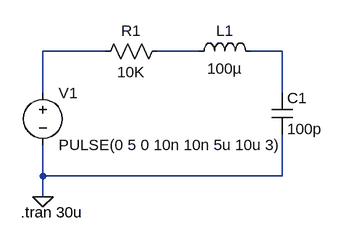
[diagram p0: schematic RLC.asc]
RLC.asc, the LTspice schematic file:
Version 4
SHEET 1 880 680
WIRE 112 48 16 48
WIRE 256 48 192 48
WIRE 384 48 336 48
WIRE 16 112 16 48
WIRE 384 112 384 48
WIRE 16 240 16 192
WIRE 384 240 384 176
WIRE 384 240 16 240
WIRE 16 272 16 240
FLAG 16 272 0
SYMBOL voltage 16 96 R0
WINDOW 123 0 0 Left 0
WINDOW 39 0 0 Left 0
SYMATTR InstName V1
SYMATTR Value PULSE(0 5 0 10n 10n 5u 10u 3)
SYMBOL res 208 32 R90
WINDOW 0 0 56 VBottom 2
WINDOW 3 32 56 VTop 2
SYMATTR InstName R1
SYMATTR Value 10K
SYMBOL ind 240 64 R270
WINDOW 0 32 56 VTop 2
WINDOW 3 5 56 VBottom 2
SYMATTR InstName L1
SYMATTR Value 100µ
SYMBOL cap 368 112 R0
SYMATTR InstName C1
SYMATTR Value 100p
TEXT -18 296 Left 2 !.tran 30u

The netlist it stands for:
* RLC.asc
V1 N001 0 PULSE(0 5 0 10n 10n 5u 10u 3)
R1 N002 N001 10K
L1 N002 N003 100µ
C1 N003 0 100p
.tran 30u
.backanno
.end